# Altium project AC_voltage_sensor.PrjPcb
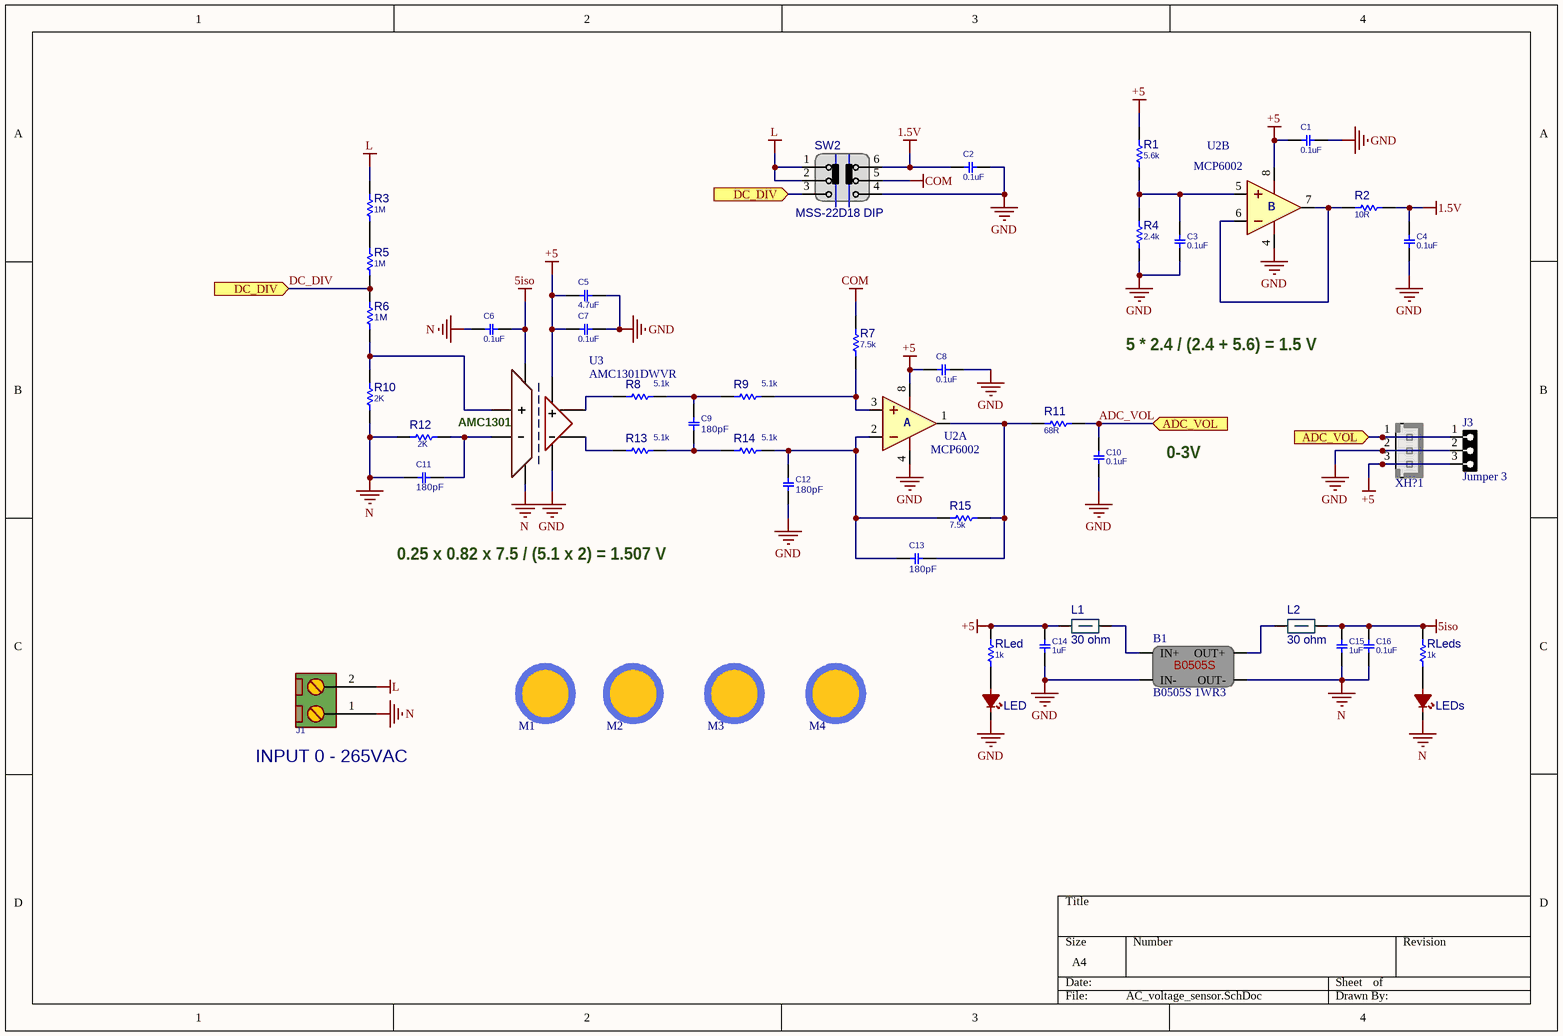
[diagram p0: AC_voltage_sensor.SchDoc]
1 sheet, 48 parts. Net scope: flat (ports and power ports of the same name join across sheets).
Board file: AC_voltage_sensor.PcbDoc

## Sheet AC_voltage_sensor.SchDoc
size A4; SheetNumber: 1; SheetTotal: 1

### Parts
B1  B0505S 1WR3  [B0505S]
C1  0.1uF  [cap_0805]
C2  0.1uF  [cap_0805]
C3  0.1uF  [cap_0805]
C4  0.1uF  [cap_0805]
C5  4.7uF  [cap_0805]
C6  0.1uF  [cap_0805]
C7  0.1uF  [cap_0805]
C8  0.1uF  [cap_0805]
C9  180pF  [cap_0805]
C10  0.1uF  [cap_0805]
C11  180pF  [cap_0805]
C12  180pF  [cap_0805]
C13  180pF  [cap_0805]
C14  1uF  [cap_0805]
C15  1uF  [cap_0805]
C16  0.1uF  [cap_0805]
J1  CONN_TB2  [TBG_2]  (value not drawn)
J3  Jumper 3  [JP3]
L1  value 30 ohm  [fb0805]
L2  value 30 ohm  [fb0805]
LED  (no value)  [LED0805RED]
LEDs  (no value)  [LED0805RED]
M1  DNP/MH  [PSPMH3]  (value not drawn)  (no BOM)
M2  DNP/MH  [PSPMH3]  (value not drawn)  (no BOM)
M3  DNP/MH  [PSPMH3]  (value not drawn)  (no BOM)
M4  DNP/MH  [PSPMH3]  (value not drawn)  (no BOM)
R1  5.6k  [R0805]
R2  10R  [R0805]
R3  1M  [R0805]
R4  2.4k  [R0805]
R5  1M  [R0805]
R6  1M  [R0805]
R7  7.5k  [R0805]
R8  5.1k  [R0805]
R9  5.1k  [R0805]
R10  2K  [R0805]
R11  68R  [R0805]
R12  2K  [R0805]
R13  5.1k  [R0805]
R14  5.1k  [R0805]
R15  7.5k  [R0805]
RLed  1k  [R0805]
RLeds  1k  [R0805]
SW2  MSS-22D18 DIP  [SW_MS22D18]
U2  MCP6002  [Soic-8]  (parts A,B of 2)
U3  AMC1301DWVR  [SOIC127P1150X280-8N]
XH?1  HHDR_3  [XHN_3]  (value not drawn)

### Ports
ADC_VOL (in), DC_DIV (in)

### Nets
1.5V: C2.2 C4.1 R2.1 SW2.6(P1)
5iso: C6.1 C15.2 C16.2 L2.2 RLeds.2 U3.1(VDD1)
+5: C1.1 C5.1 C7.1 C8.1 C14.2 J3.3 L1.1 R1.2 RLed.2 U2.8(VDD) U3.8(VDD2) XH?1.3
COM: R7.2 SW2.5(P3)
GND: B1.1(IN-) C1.2 C2.1 C3.2 C4.2 C5.2 C7.2 C8.2 C10.1 C12.2 C14.1 J3.2 LED.2(K) R4.1 SW2.4(P4) U2.4(VSS) U3.5(GND2) XH?1.2
L: J1.2 R3.2 SW2.1(P1) SW2.2(P3)
N: B1.3(OUT-) C6.2 C11.2 C15.1 C16.1 J1.1 LEDs.2(K) R10.1 R12.2 U3.4(GND1)
ADC_VOL: C10.2 J3.1 R11.2 XH?1.1 ; port ADC_VOL
DC_DIV: R5.2 R6.2 SW2.3(P4) ; port DC_DIV
NetB1_2: B1.2(IN+) L1.2
NetB1_4: B1.4(OUT+) L2.1
NetC3_1: C3.1 R1.1 R4.2 U2.5(IN+)
NetC9_1: C9.1 R8.1 R9.2
NetC9_2: C9.2 R13.1 R14.2
NetC11_1: C11.1 R12.1 U3.3(-)
NetC12_1: C12.1 C13.1 R14.1 R15.1 U2.2(IN-)
NetC13_2: C13.2 R11.1 R15.2 U2.1(OUT)
NetLED_1: LED.1(A) RLed.1
NetLEDs_1: LEDs.1(A) RLeds.1
NetR2_2: R2.2 U2.6(IN-) U2.7(OUT)
NetR3_1: R3.1 R5.1
NetR6_1: R6.1 R10.2 U3.2(+)
NetR7_1: R7.1 R9.1 U2.3(IN+)
NetR8_2: R8.2 U3.7(+)
NetR13_2: R13.2 U3.6(-)

### Notes on the sheet
- 5 * 2.4 / (2.4 + 5.6) = 1.5 V
- 0-3V
- 0.25 x 0.82 x 7.5 / (5.1 x 2) = 1.507 V
- (near J1) INPUT 0 - 265VAC
- (in symbol AMC1301DWVR) AMC1301
- (in symbol B0505S 1WR3) B0505S
- (in symbol MCP6002, part A) A
- (in symbol MCP6002, part B) B

### Library data of the parts
B1 = B0505S 1WR3: B0505S 1WR3 Isolated Module DC DC Converter
C1-C16 = CAP SMD: PARAM: -, -%; MANF_P#: MANF_PART#; PARAM2: -V; PRICE: 100= 1$; MANF: -; ASSEMBLY: ASSEMBLY
  C1-C4 C6-C8 C10 C16: VALUE: 0.1uF
  C5: VALUE: 4.7uF
  C9 C11-C13: VALUE: 180pF
  C14 C15: VALUE: 1uF
J1 = CONN_TB2: CONN, TERMINAL BLOCK, 5.08mm pitch; VALUE: CONN_TB2
J3 = JP3: Value: J3
L1 L2 = RES SMD_1: Ferrite Bead, 30 ohm @ 100 MHz, 6 A, 0805; MANF_P#: WSLP0805R0100FEA; MANF: VISHAY; PARAM: 0.5W, -55~155oC; DESC: DESCRIPTION; DIST#: MOUSER; PARAM2: 1%; ASSEMBLY: ASSEMBLY; PRICE: 0.5$
LED LEDs = LED Red SMD: DESC: DESCRIPTION; MANF_P#: MANF_PART#; PARAM2: 2.2V; MANF: MANF; ASSEMBLY: ASSEMBLY; PRICE: 36t@Javan
M1-M4 = PSPMH3: PSPMH3 Plastic Spacer mouting, Hole 3mm; ASSEMBLY: DNP; VALUE: DNP/MH
R1-R15 RLed RLeds = RES SMD: MANF_P#: WSLP0805R0100FEA; MANF: VISHAY; PARAM: 0.5W, -55~155oC; DESC: DESCRIPTION; DIST#: MOUSER; PARAM2: 1%; ASSEMBLY: ASSEMBLY; PRICE: 0.5$
  R1: VALUE: 5.6k
  R2: VALUE: 10R
  R3 R5 R6: VALUE: 1M
  R4: VALUE: 2.4k
  R7 R15: VALUE: 7.5k
  R8 R9 R13 R14: VALUE: 5.1k
  R10 R12: VALUE: 2K
  R11: VALUE: 68R
  RLed RLeds: VALUE: 1k
SW2 = SW MSS-22D18G2: SW MSS-22D18 Công Tắc Trượt 6 Chân ON-ON 2P2T 0.5A; MANF_PART#: OS102011MS2QN1; MANF: C&K; VALUE: SlideSwitch; DESC: DESCRIPTION; ASSEMBLY: ASSEMBLY; PARAM: PARAM; PRICE: 0.4$
U2 = MCP6002: MCP6002  1MHz, Low-Power dual Op Amp; MF: Microchip; MP: MCP1700T-3602E/MB; SnapEDA_Link: https://www.snapeda.com/parts/MCP1700T-3602E/MB/Microchip/view-part/1202431/?ref=snap; Availability: Unavailable; Value: *; Price: None; Package: SOT-89 Microchip
U3 = AMC1301DWVR: AMC1301DWVR Isolation Amplifer, Opamp
XH?1 = XHN_3: XHN 3 JST-XH pitch: 2.5mm; VALUE: HHDR_3